# EAGLE design control (EAGLE 6.5.0)
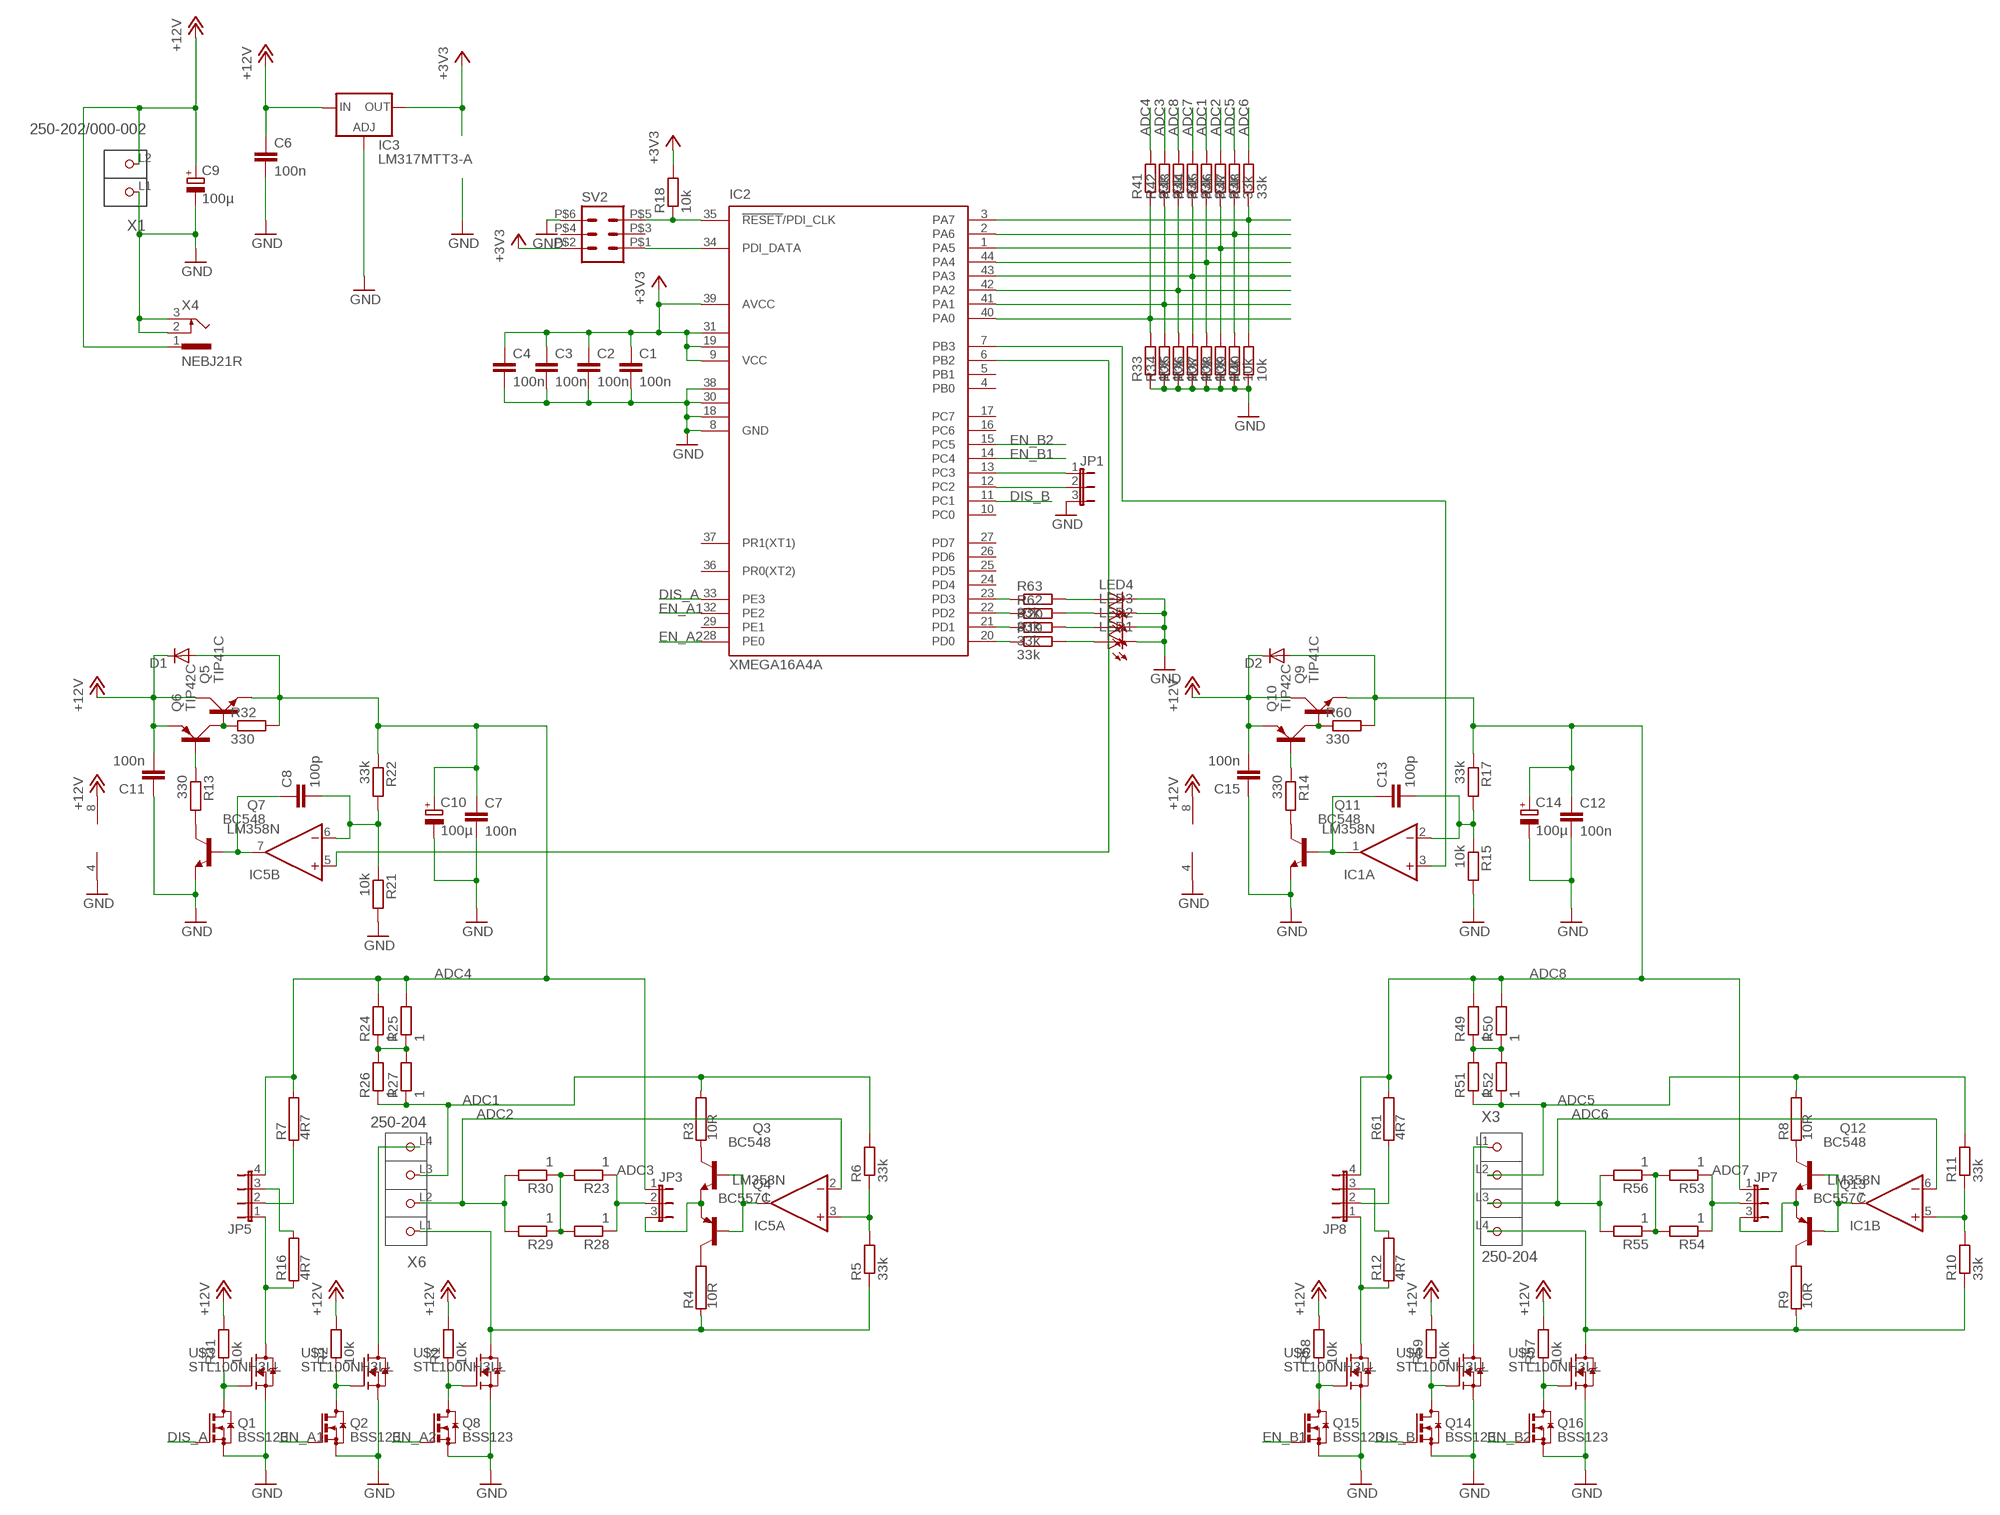
[diagram p0: schematic, sheet 1]

## Parts
C1  100n  C-EUC0805K  [C0805K]
C2  100n  C-EUC0805K  [C0805K]
C3  100n  C-EUC0805K  [C0805K]
C4  100n  C-EUC0805K  [C0805K]
C6  100n  C-EUC0805K  [C0805K]
C7  100n  C-EUC0805K  [C0805K]
C8  100p  C-EUC0805K  [C0805K]
C9  100µ  CPOL-EUE2.5-7  [E2,5-7]
C10  100µ  CPOL-EUE2.5-7  [E2,5-7]
C11  100n  C-EUC0805  [C0805]
C12  100n  C-EUC0805K  [C0805K]
C13  100p  C-EUC0805K  [C0805K]
C14  100µ  CPOL-EUE2.5-7  [E2,5-7]
C15  100n  C-EUC0805  [C0805]
D1  DIODE-DO41-7.6  [DO41-7.6]
D2  DIODE-DO41-7.6  [DO41-7.6]
IC1  LM358N  [DIL08]
IC2  XMEGA16A4A  [TQFP44]
IC3  LM317MTT3-A  [SOT223]
IC5  LM358N  [DIL08]
JP1  JP2E  [JP2]
JP3  JP2E  [JP2]
JP5  JP4E  [JP4]
JP7  JP2E  [JP2]
JP8  JP4E  [JP4]
LED1  LEDCHIPLED_0805  [CHIPLED_0805]
LED2  LEDCHIPLED_0805  [CHIPLED_0805]
LED3  LEDCHIPLED_0805  [CHIPLED_0805]
LED4  LEDCHIPLED_0805  [CHIPLED_0805]
Q1  BSS123  [SOT23]
Q2  BSS123  [SOT23]
Q3  BC548  [TO92-EBC]
Q4  BC557C  [TO92-EBC]
Q5  TIP41C  [TO220AV]
Q6  TIP42C  [TO220AV]
Q7  BC548  [TO92-EBC]
Q8  BSS123  [SOT23]
Q9  TIP41C  [TO220AV]
Q10  TIP42C  [TO220AV]
Q11  BC548  [TO92-EBC]
Q12  BC548  [TO92-EBC]
Q13  BC557C  [TO92-EBC]
Q14  BSS123  [SOT23]
Q15  BSS123  [SOT23]
Q16  BSS123  [SOT23]
R1  10k  R-EU_M0805  [M0805]
R2  10k  R-EU_M0805  [M0805]
R3  10R  RHPS58  [HPS58]
R4  10R  RHPS58  [HPS58]
R5  33k  R-EU_M0805  [M0805]
R6  33k  R-EU_M0805  [M0805]
R7  4R7  RKH208-8R  [KH208R-8]
R8  10R  RHPS58  [HPS58]
R9  10R  RHPS58  [HPS58]
R10  33k  R-EU_M0805  [M0805]
R11  33k  R-EU_M0805  [M0805]
R12  4R7  RKH208-8R  [KH208R-8]
R13  330  R-EU_M0805  [M0805]
R14  330  R-EU_M0805  [M0805]
R15  10k  R-EU_M0805  [M0805]
R16  4R7  RKH208-8R  [KH208R-8]
R17  33k  R-EU_M0805  [M0805]
R18  10k  R-EU_M0805  [M0805]
R19  33k  R-EU_M0805  [M0805]
R20  33k  R-EU_M0805  [M0805]
R21  10k  R-EU_M0805  [M0805]
R22  33k  R-EU_M0805  [M0805]
R23  1  R-EU_0207/2V  [0207/2V]
R24  1  R-EU_0207/2V  [0207/2V]
R25  1  R-EU_0207/2V  [0207/2V]
R26  1  R-EU_0207/2V  [0207/2V]
R27  1  R-EU_0207/2V  [0207/2V]
R28  1  R-EU_0207/2V  [0207/2V]
R29  1  R-EU_0207/2V  [0207/2V]
R30  1  R-EU_0207/2V  [0207/2V]
R31  10k  R-EU_M0805  [M0805]
R32  330  R-EU_M0805  [M0805]
R33  10k  R-EU_M0805  [M0805]
R34  10k  R-EU_M0805  [M0805]
R35  10k  R-EU_M0805  [M0805]
R36  10k  R-EU_M0805  [M0805]
R37  10k  R-EU_M0805  [M0805]
R38  10k  R-EU_M0805  [M0805]
R39  10k  R-EU_M0805  [M0805]
R40  10k  R-EU_M0805  [M0805]
R41  33k  R-EU_M0805  [M0805]
R42  33k  R-EU_M0805  [M0805]
R43  33k  R-EU_M0805  [M0805]
R44  33k  R-EU_M0805  [M0805]
R45  33k  R-EU_M0805  [M0805]
R46  33k  R-EU_M0805  [M0805]
R47  33k  R-EU_M0805  [M0805]
R48  33k  R-EU_M0805  [M0805]
R49  1  R-EU_0207/2V  [0207/2V]
R50  1  R-EU_0207/2V  [0207/2V]
R51  1  R-EU_0207/2V  [0207/2V]
R52  1  R-EU_0207/2V  [0207/2V]
R53  1  R-EU_0207/2V  [0207/2V]
R54  1  R-EU_0207/2V  [0207/2V]
R55  1  R-EU_0207/2V  [0207/2V]
R56  1  R-EU_0207/2V  [0207/2V]
R57  10k  R-EU_M0805  [M0805]
R58  10k  R-EU_M0805  [M0805]
R59  10k  R-EU_M0805  [M0805]
R60  330  R-EU_M0805  [M0805]
R61  4R7  RKH208-8R  [KH208R-8]
R62  33k  R-EU_M0805  [M0805]
R63  33k  R-EU_M0805  [M0805]
SV2  ML66S  [ML6S]
U$1  STL100NH3LL  [PG-TDSON-8]
U$2  STL100NH3LL  [PG-TDSON-8]
U$3  STL100NH3LL  [PG-TDSON-8]
U$4  STL100NH3LL  [PG-TDSON-8]
U$5  STL100NH3LL  [PG-TDSON-8]
U$6  STL100NH3LL  [PG-TDSON-8]
X1  250-202/000-002  [P-250-202]
X3  250-204  [P-250-204]
X4  NEBJ21R  [NEBJ21R]
X6  250-204  [P-250-204]

## Nets
+3V3: C1.1 C2.1 C3.1 C4.1 IC2.9(VCC) IC2.19(VCC1) IC2.31(VCC2) IC2.39(AVCC) IC3.2(OUT) R18.2 SV2.P$2
+12V: C6.1 C9.+ C11.2 C15.2 D1.C D2.C IC1.8(P:V+) IC3.3(IN) IC5.8(P:V+) Q5.C Q6.E Q9.C Q10.E R1.2 R2.2 R31.2 R57.2 R58.2 R59.2 X1.L2(P2) X4.1
ADC1: R3.2 R6.2 R26.1 R27.1 R45.2 X6.L3(P3)
ADC2: IC5.2(A:-IN) R29.2 R30.2 R46.2 X6.L2(P2)
ADC3: JP3.2 R23.1 R28.1 R42.2
ADC4: C7.1 C10.+ D1.A JP3.1 JP5.4 Q5.E R7.2 R22.1 R24.2 R25.2 R32.2 R41.2
ADC5: R8.2 R11.2 R47.2 R51.1 R52.1 X3.L2(P2)
ADC6: IC1.6(B:-IN) R48.2 R55.2 R56.2 X3.L3(P3)
ADC7: JP7.2 R44.2 R53.1 R54.1
ADC8: C12.1 C14.+ D2.A JP7.1 JP8.4 Q9.E R17.1 R43.2 R49.2 R50.2 R60.2 R61.2
DIS_A: IC2.33(PE3) Q1.1(G)
DIS_B: IC2.11(PC1) Q14.1(G)
EN_A1: IC2.32(PE2) Q2.1(G)
EN_A2: IC2.28(PE0) Q8.1(G)
EN_B1: IC2.14(PC4) Q15.1(G)
EN_B2: IC2.15(PC5) Q16.1(G)
GND: C1.2 C2.2 C3.2 C4.2 C6.2 C7.2 C9.- C10.- C11.1 C12.2 C14.- C15.1 IC1.4(P:V-) IC2.8(GND) IC2.18(GND1) IC2.30(GND2) IC2.38(GND3) IC3.1(ADJ) IC5.4(P:V-) JP1.3 LED1.C LED2.C LED3.C LED4.C Q1.2(S) Q2.2(S) Q7.E Q8.2(S) Q11.E Q14.2(S) Q15.2(S) Q16.2(S) R15.2 R21.2 R33.1 R34.1 R35.1 R36.1 R37.1 R38.1 R39.1 R40.1 SV2.P$6 U$1.1(S) U$1.2(S) U$1.3(S) U$2.1(S) U$2.2(S) U$2.3(S) U$3.1(S) U$3.2(S) U$3.3(S) U$4.1(S) U$4.2(S) U$4.3(S) U$5.1(S) U$5.2(S) U$5.3(S) U$6.1(S) U$6.2(S) U$6.3(S) X1.L1(P1) X4.2 X4.3
N$1: R4.1 R5.1 U$2.5(D) U$2.6(D) U$2.7(D) U$2.8(D) U$2.TH(D) X6.L1(P1)
N$2: R9.1 R10.1 U$5.5(D) U$5.6(D) U$5.7(D) U$5.8(D) U$5.TH(D) X3.L4(P4)
N$3: U$4.5(D) U$4.6(D) U$4.7(D) U$4.8(D) U$4.TH(D) X3.L1(P1)
N$4: U$1.5(D) U$1.6(D) U$1.7(D) U$1.8(D) U$1.TH(D) X6.L4(P4)
N$5: IC2.20(PD0) R19.1
N$6: Q1.3(D) R31.1 U$3.4(G)
N$7: Q3.C R3.1
N$8: Q4.C R4.2
N$9: IC5.1(A:OUT) Q3.B Q4.B
N$10: IC2.21(PD1) R20.1
N$11: IC5.3(A:+IN) R5.2 R6.1
N$12: Q12.C R8.1
N$13: Q7.C R13.2
N$14: JP5.1 R16.1 U$3.5(D) U$3.6(D) U$3.7(D) U$3.8(D) U$3.TH(D)
N$15: JP5.3 R16.2
N$16: JP5.2 R7.1
N$17: IC2.35(!RESET!/PDI_CLK) R18.1 SV2.P$5
N$18: IC2.40(PA0) R33.2 R41.1
N$19: IC2.41(PA1) R34.2 R42.1
N$20: IC2.42(PA2) R35.2 R43.1
N$21: IC2.43(PA3) R36.2 R44.1
N$22: IC2.44(PA4) R37.2 R45.1
N$23: IC2.1(PA5) R38.2 R46.1
N$24: IC2.2(PA6) R39.2 R47.1
N$25: IC2.3(PA7) R40.2 R48.1
N$26: Q6.B R13.1
N$27: IC2.13(PC3) JP1.1
N$28: C8.1 IC5.7(B:OUT) Q7.B
N$29: R23.2 R28.2 R29.1 R30.1
N$30: C8.2 IC5.6(B:-IN) R21.1 R22.2
N$31: IC2.6(PB2) IC5.5(B:+IN)
N$32: Q5.B Q6.C R32.1
N$33: R24.1 R25.1 R26.2 R27.2
N$34: JP3.3 Q3.E Q4.E
N$35: Q2.3(D) R2.1 U$1.4(G)
N$36: Q8.3(D) R1.1 U$2.4(G)
N$37: Q13.C R9.2
N$38: IC2.12(PC2) JP1.2
N$39: IC2.22(PD2) R62.1
N$40: IC1.7(B:OUT) Q12.B Q13.B
N$41: IC1.5(B:+IN) R10.2 R11.1
N$42: JP8.1 R12.1 U$6.5(D) U$6.6(D) U$6.7(D) U$6.8(D) U$6.TH(D)
N$43: JP8.3 R12.2
N$44: IC2.34(PDI_DATA) SV2.P$1
N$45: JP8.2 R61.1
N$46: C13.1 IC1.1(A:OUT) Q11.B
N$47: C13.2 IC1.2(A:-IN) R15.1 R17.2
N$48: IC1.3(A:+IN) IC2.7(PB3)
N$49: Q9.B Q10.C R60.1
N$50: Q11.C R14.2
N$51: Q10.B R14.1
N$52: R49.1 R50.1 R51.2 R52.2
N$53: R53.2 R54.2 R55.1 R56.1
N$54: JP7.3 Q12.E Q13.E
N$55: Q14.3(D) R59.1 U$4.4(G)
N$56: Q15.3(D) R58.1 U$6.4(G)
N$57: Q16.3(D) R57.1 U$5.4(G)
N$58: IC2.23(PD3) R63.1
N$59: LED4.A R63.2
N$60: LED3.A R62.2
N$61: LED2.A R20.2
N$62: LED1.A R19.2
Unconnected: IC2.4(PB0) IC2.5(PB1) IC2.10(PC0) IC2.16(PC6) IC2.17(PC7) IC2.24(PD4) IC2.25(PD5) IC2.26(PD6) IC2.27(PD7) IC2.29(PE1) IC2.36(PR0(XT2)) IC2.37(PR1(XT1)) SV2.P$3 SV2.P$4

## Library data of the parts
C1-C4 C6-C8 C11-C13 C15 = resistor:C-EU: CAPACITOR, European symbol
C9 C10 C14 = resistor:CPOL-EU: POLARIZED CAPACITOR, European symbol
D1 D2 = diode:DIODE-: DIODE
IC1 IC5 = linear:LM358: OP AMP also LM158; LM258; LM2904 Source: http://cache.national.com/ds/LM/LM158.pdf
IC2 = atmel:XMEGA16A4: MICROCONTROLLER Features High-performance, Low-power 8/16-bit AVR XMEGA Microcontroller Non-Volatile Program and Data Memories - 16 KB - 128 KB of In-System Self-Programmable Flash - 4 KB - 8 KB Boot Code Section with Independent Lock Bits - 1 KB - 2 KB EEPROM - 2 KB - 8 KB Internal SRAM Peripheral Features - Four-channel DMA Controller with support for external requests - Eight-channel Event System - Five 16-bit Timer/Counters Three Timer/Counters with 4 Output Compare or Input Capture channels Two Timer/Counters with 2 Output Compare or Input Capture channels High-Resolution Extensions on all Timer/Counters Advanced Waveform Extension on one Timer/Counter - Five USARTs IrDA Extension on one USART - Two Two-Wire Interfaces with dual address match (I2C and SMBus compatible) - Two SPIs (Serial Peripheral Interfaces) peripherals - AES and DES Crypto Engine - 16-bit Real Time Counter with Separate Oscillator - One Twelve-channel, 12-bit, 2 Msps Analog to Digital Converter - One Two-channel, 12-bit, 1 Msps Digital to Analog Converter - Two Analog Comparators with Window compare function - External Interrupts on all General Purpose I/O pins - Programmable Watchdog Timer with Separate On-chip Ultra Low Power Oscillator Special Microcontroller Features - Power-on Reset and Programmable Brown-out Detection - Internal and External Clock Options with PLL - Programmable Multi-level Interrupt Controller - Sleep Modes: Idle, Power-down, Standby, Power-save, Extended Standby - Advanced Programming, Test and Debugging Interfaces PDI (Program and Debug Interface) for programming, test and debugging I/O and Packages - 34 Programmable I/O Lines - 44 - lead TQFP - 44 - pad VQFN/QFN - 49 - ball VFBGA Operating Voltage - 1.6 - 3.6V Speed performance - 0 - 12 MHz @ 1.6 - 3.6V - 0 - 32 MHz @ 2.7 - 3.6V Drawn by Dipl.-Ing. (FH) Robert Siegler Created: 27.05.09; OC_FARNELL: unknown; OC_NEWARK: unknown
IC3 = v-reg:LM317?*: 500 mA Adjustable Output Positive Voltage Regulator Source: http://www.onsemi.co.jp .. LM317M-D.PDF
JP1 JP3 JP7 = jumper:JP2E: JUMPER
JP5 JP8 = jumper:JP4E: JUMPER
LED1-LED4 = led:LED: LED OSRAM: - CHIPLED LG R971, LG N971, LY N971, LG Q971, LY Q971, LO R971, LY R971 LH N974, LH R974 LS Q976, LO Q976, LY Q976 LO Q996 - Hyper CHIPLED LW Q18S LB Q993, LB Q99A, LB R99A - SideLED LS A670, LO A670, LY A670, LG A670, LP A670 LB A673, LV A673, LT A673, LW A673 LH A674 LY A675 LS A676, LA A676, LO A676, LY A676, LW A676 LS A679, LY A679, LG A679 - Hyper Micro SIDELED® LS Y876, LA Y876, LO Y876, LY Y876 LT Y87S - SmartLED LW L88C, LW L88S LB L89C, LB L89S, LG L890 LS L89K, LO L89K, LY L89K LS L896, LA L896, LO L896, LY L896 - TOPLED LS T670, LO T670, LY T670, LG T670, LP T670 LSG T670, LSP T670, LSY T670, LOP T670, LYG T670 LG T671, LOG T671, LSG T671 LB T673, LV T673, LT T673, LW T673 LH T674 LS T676, LA T676, LO T676, LY T676, LB T676, LH T676, LSB T676, LW T676 LB T67C, LV T67C, LT T67C, LS T67K, LO T67K, LY T67K, LW E67C LS E67B, LA E67B, LO E67B, LY E67B, LB E67C, LV E67C, LT E67C LW T67C LS T679, LY T679, LG T679 LS T770, LO T770, LY T770, LG T770, LP T770 LB T773, LV T773, LT T773, LW T773 LH T774 LS E675, LA E675, LY E675, LS T675 LS T776, LA T776, LO T776, LY T776, LB T776 LHGB T686 LT T68C, LB T68C - Hyper Mini TOPLED® LB M676 - Mini TOPLED Santana® LG M470 LS M47K, LO M47K, LY M47K Source: http://www.osram.convergy.de LUXEON: - LUMILED® LXK2-PW12-R00, LXK2-PW12-S00, LXK2-PW14-U00, LXK2-PW14-V00 LXK2-PM12-R00, LXK2-PM12-S00, LXK2-PM14-U00 LXK2-PE12-Q00, LXK2-PE12-R00, LXK2-PE12-S00, LXK2-PE14-T00, LXK2-PE14-U00 LXK2-PB12-K00, LXK2-PB12-L00, LXK2-PB12-M00, LXK2-PB14-N00, LXK2-PB14-P00, LXK2-PB14-Q00 LXK2-PR12-L00, LXK2-PR12-M00, LXK2-PR14-Q00, LXK2-PR14-R00 LXK2-PD12-Q00, LXK2-PD12-R00, LXK2-PD12-S00 LXK2-PH12-R00, LXK2-PH12-S00 LXK2-PL12-P00, LXK2-PL12-Q00, LXK2-PL12-R00 Source: www.luxeon.com KINGBRIGHT: KA-3528ASYC Source: www.kingbright.com
Q1 Q2 Q8 Q14-Q16 = transistor-small-signal:BSS123: N-CHANNEL MOS FET
Q3 Q7 Q11 Q12 = transistor-npn:BC548*: NPN Transistor
Q4 Q13 = transistor-pnp:BC557*: PNP Transistror
Q5 Q9 = transistor-power:TIP41C: NPN TRANSISTOR
Q6 Q10 = transistor-power:TIP42C: PNP TRANSISTOR
R1 R2 R5 R6 R10 R11 R13-R15 R17-R60 R62 R63 = resistor:R-EU_: RESISTOR, European symbol
R3 R4 R7-R9 R12 R16 R61 = resistor-power:R: Power Resitor; OC_FARNELL: unknown; OC_NEWARK: unknown
SV2 = con-ml:ML6: HARTING
U$1-U$6 = teile:STL100NH3LL: STL100NH3LL n-fet 30V 12,5A(100A) 3,2mohm
X1 = con-wago_250:250-202/000-002: Serie 250, Stand: 01.01.2012. Die jeweils aktuellen Daten zu diesem Artikel finden Sie in unserem Produktkatalog, den Sie unter www.wago.com einsehen können. As of: 01/01/2012. Please find the newest data for this article in our product catalogue, which can be viewed under www.wago.com.
X3 X6 = con-wago_250:250-204: Serie 250, 1-Leiter-Klemmenleiste für Leiterplatten 1 Lötstift/Pol versetzt / Series 250, 1-conductor PCB terminal strip 1 solder pin/pole, staggered Polzahl / Pole No.: 4 Rastermaß / Pitch: 3.5 mm Bemessungsspannung / Rated Voltage: 320 V Nennstrom / Nominal Current: 8 A Leiterquerschnitt / Conductor Size: 0.2 - 1.5 mm² Anschlusstechnik / Connection Technology: Steckklemm-Anschluss Lötstiftlänge: / Solder Pin Length: 3.6 mm Leitereinführung (zur Platine) / Conductor entry angle (to PCB): 45 ° Farbe / Color: grau / gray Stand: 01.01.2012. Die jeweils aktuellen Daten zu diesem Artikel finden Sie in unserem Produktkatalog, den Sie unter www.wago.com einsehen können. As of: 01/01/2012. Please find the newest data for this article in our product catalogue, which can be viewed under www.wago.com.
X4 = con-lumberg:NEBJ21R: Netzgeräte-Einbaukupplung abgewinkelte Ausführung mit Öffner Source: http://www.lumberg.com/Produkte/PDFs/NEB_J21R.pdf MARUSHIN ELECTRIC MFG.CO. LTD - Draw No: MJ196P - NEB J 21 R.pdf; MPN: NEB/J 21 R; OC_FARNELL: 1217039; OC_NEWARK: 97K6460

## Board
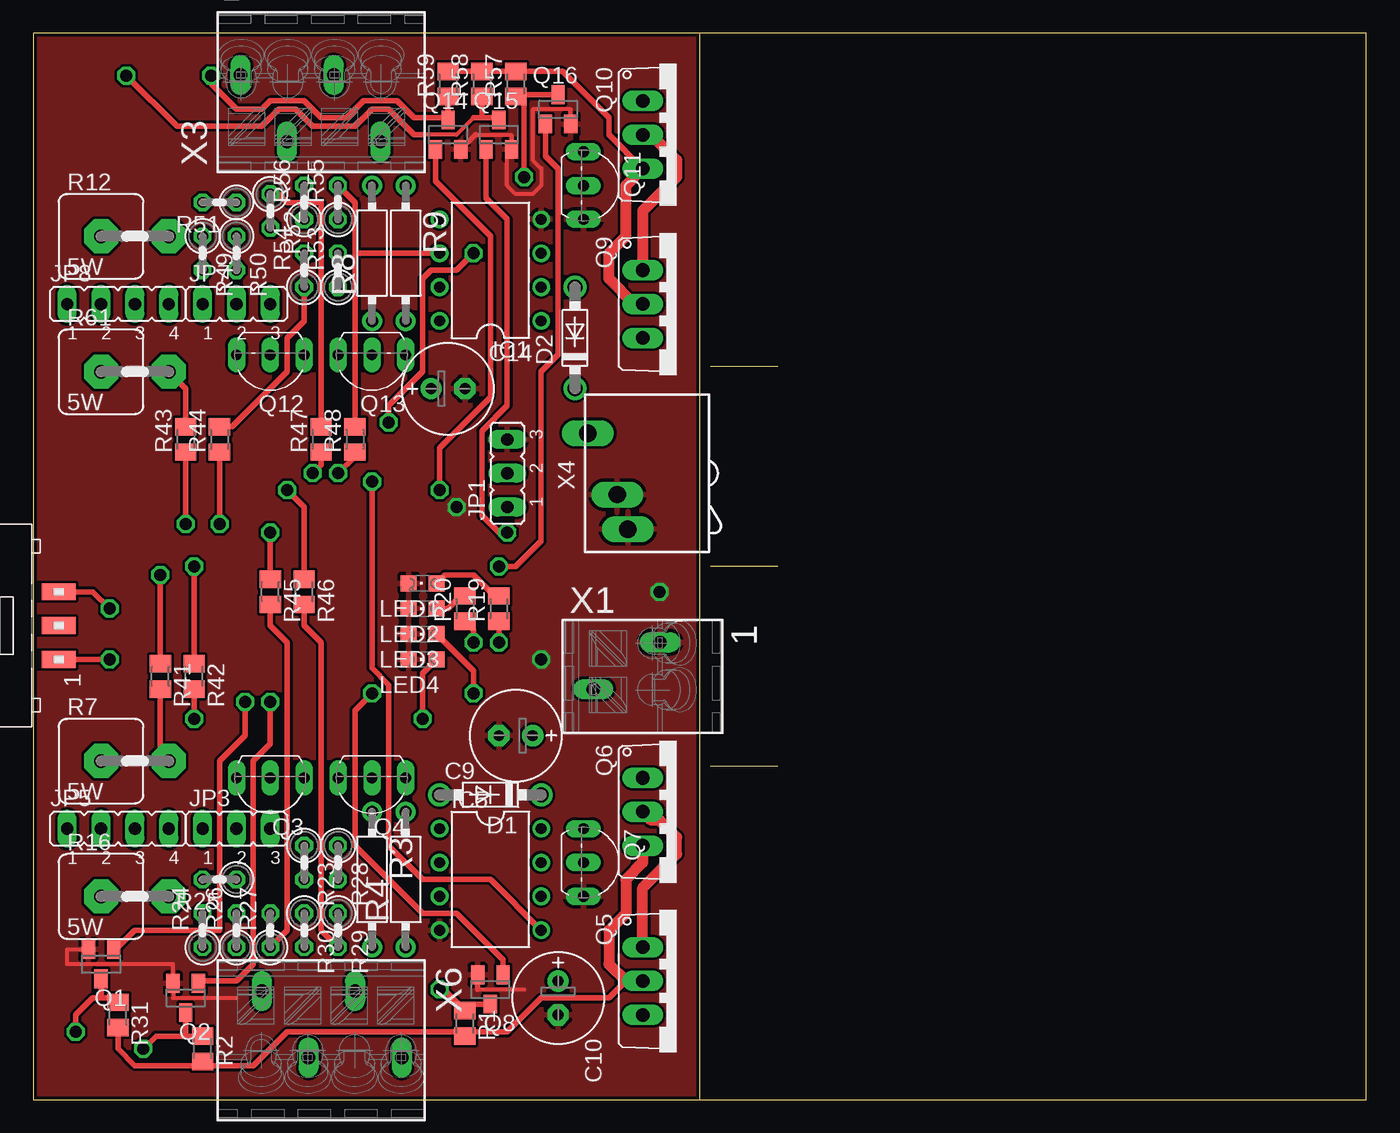
[diagram p1: board, top side]
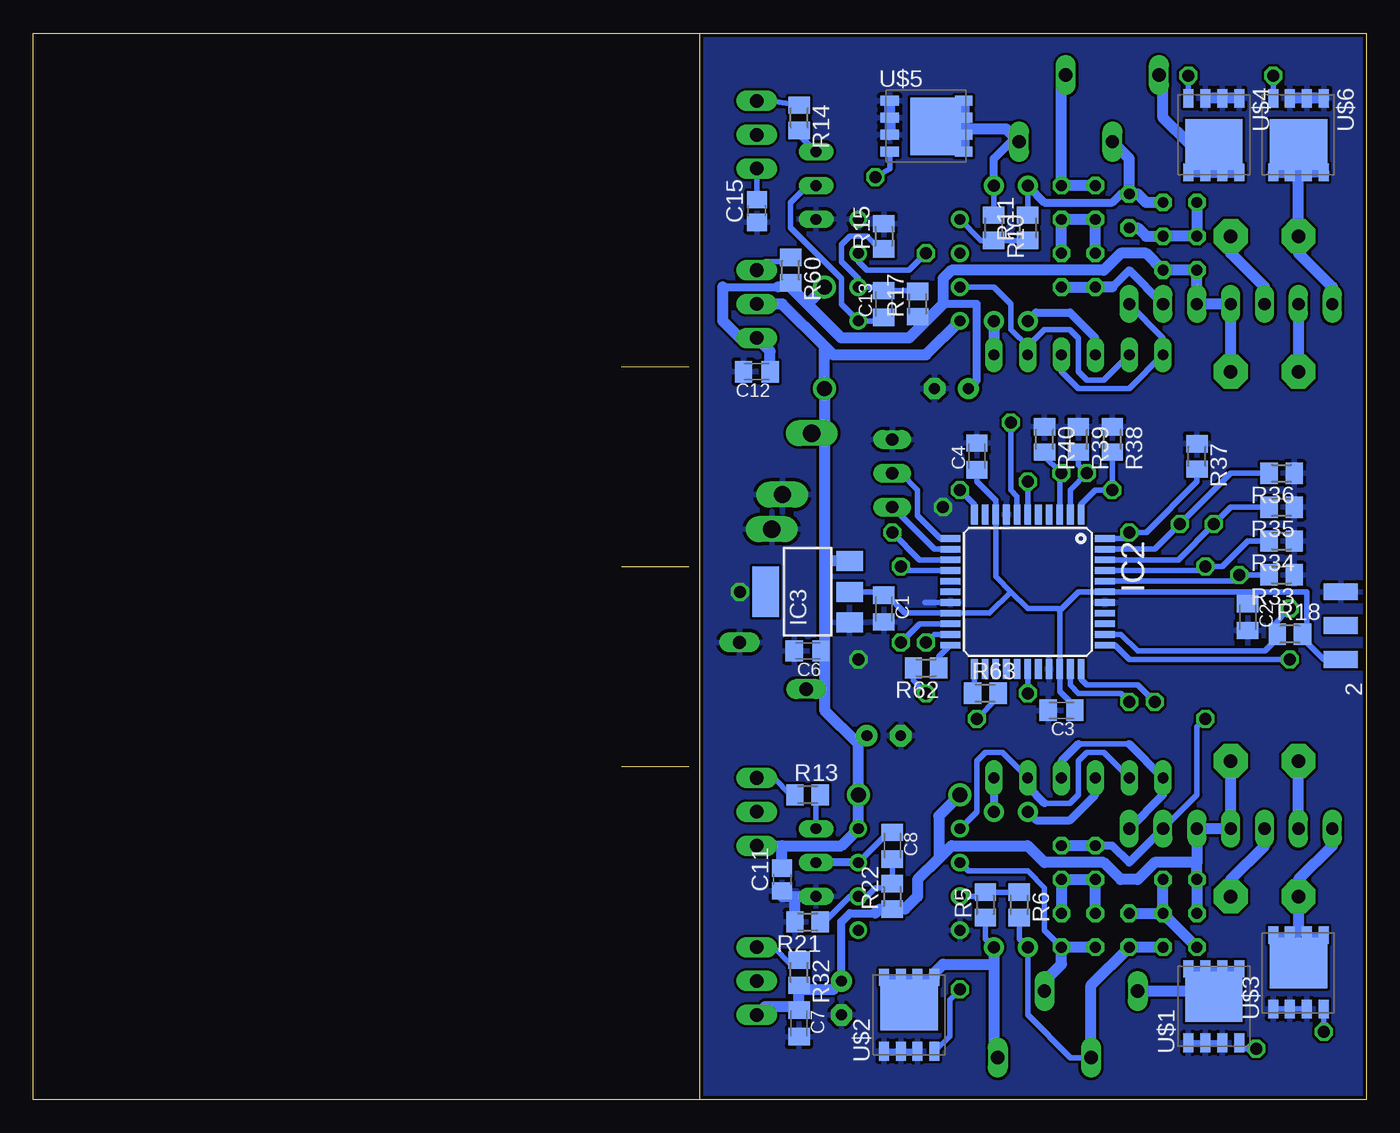
[diagram p2: board, bottom side, seen from below]

Size 100 x 80 mm. Coordinates in mm from the lower left corner, seen from the top.
Outline: 50,0 0,0 0,80 50,80
Outline: 50,0 100,0 100,80 50,80
Outline: 50,0 50,80
Outline: 55.88,40 50.8,40
Outline: 55.88,25 50.8,25
Outline: 55.88,55 50.8,55
Copper layers (1*16): Top 0.035mm / dielectric 1.5mm / Bottom 0.035mm
Design rules "default *": minimum track width 10mil, minimum drill 24mil, track to track 8mil, track to pad 8mil, pad to pad 8mil, via to via 8mil, smd to smd 8mil, copper to edge 10mil, drill to drill 8mil, minimum pad ring 10mil, minimum via ring 8mil, stop-mask expansion 4mil, vias tented up to drill 0mil, thermal gap 10mil

### Footprints (pad centres in the part's own frame; a part is rotated, then mirrored left to right if it is on the bottom)
C0805K = smd 1.3 x 1.6: 1 -1,0; 2 1,0
E2,5-7 = drill 0.813 pad 1.6: + -1.27,0 | drill 0.813 pad 1.6 octagon: - 1.27,0
C0805 = smd 1.3 x 1.5: 1 -0.85,0; 2 0.85,0
DO41-7.6 = drill 1.1 pad 1.7: A 3.81,0; C -3.81,0
DIL08 = drill 0.813 pad 1.27: 1 -3.81,-3.81; 2 -1.27,-3.81; 3 1.27,-3.81; 4 3.81,-3.81; 5 3.81,3.81; 6 1.27,3.81; 7 -1.27,3.81; 8 -3.81,3.81
TQFP44 = smd 1.5 x 0.5: 1 -5.8,4; 2 -5.8,3.2; 3 -5.8,2.4; 4 -5.8,1.6; 5 -5.8,0.8; 6 -5.8,0; 7 -5.8,-0.8; 8 -5.8,-1.6; 9 -5.8,-2.4; 10 -5.8,-3.2; 11 -5.8,-4; 23 5.8,-4; 24 5.8,-3.2; 25 5.8,-2.4; 26 5.8,-1.6; 27 5.8,-0.8; 28 5.8,0; 29 5.8,0.8; 30 5.8,1.6; 31 5.8,2.4; 32 5.8,3.2; 33 5.8,4 | smd 0.5 x 1.5: 12 -4,-5.8; 13 -3.2,-5.8; 14 -2.4,-5.8; 15 -1.6,-5.8; 16 -0.8,-5.8; 17 0,-5.8; 18 0.8,-5.8; 19 1.6,-5.8; 20 2.4,-5.8; 21 3.2,-5.8; 22 4,-5.8; 34 4,5.8; 35 3.2,5.8; 36 2.4,5.8; 37 1.6,5.8; 38 0.8,5.8; 39 0,5.8; 40 -0.8,5.8; 41 -1.6,5.8; 42 -2.4,5.8; 43 -3.2,5.8; 44 -4,5.8
SOT223 = smd 1.5 x 2: 1 -2.3,-3.15; 2 0,-3.15; 3 2.3,-3.15 | smd 3.8 x 2: 4 0,3.15
JP2 = drill 0.914 long: 1 -2.54,0; 2 0,0; 3 2.54,0
JP4 = drill 0.914 long: 1 -3.81,0; 2 -1.27,0; 3 1.27,0; 4 3.81,0
CHIPLED_0805 = smd 1.2 x 1.2: A 0,-1.05; C 0,1.05
SOT23 = smd 1 x 1.4: 1 -0.95,-1.1; 2 0.95,-1.1; 3 0,1.1
TO92-EBC = drill 0.813 long: B 0,-1.27; C -2.54,-1.27; E 2.54,-1.27
TO220AV = drill 1.016 long: B -2.54,-2.54; C 0,-2.54; E 2.54,-2.54
M0805 = smd 1.3 x 1.6: 1 -0.95,0; 2 0.95,0
HPS58 = drill 0.9 pad 1.5: 1 -5.08,0; 2 5.08,0
KH208R-8 = drill 1.016 pad 2.54 octagon: 1 -2.54,0; 2 2.54,0
0207/2V = drill 0.813 octagon: 1 -1.27,0; 2 1.27,0
ML6S = smd 1.27 x 2.54: P$1 -2.54,0; P$3 0,0; P$5 2.54,0 | smd 1.27 x 2.54 bottom: P$2 -2.54,0; P$4 0,0; P$6 2.54,0
PG-TDSON-8 = smd 1.4 x 0.75: 1 -2.725,1.905; 2 -2.725,0.635; 3 -2.725,-0.635; 4 -2.725,-1.905 | smd 1.3 x 0.75: 5 2.825,-1.905; 6 2.825,-0.635; 7 2.825,0.635; 8 2.825,1.905 | smd 3.78 x 4.305: TH 0.725,0
P-250-202 = drill 1 long: L1 1.3,2.55; L2 -3.7,-0.95
P-250-204 = drill 1 long: L1 1.3,6.05; L2 -3.7,2.55; L3 1.3,-0.95; L4 -3.7,-4.45
NEBJ21R = drill 1.3 pad 1.905 long: 1 -3,-9.2; 2 1.6,-7; 3 4.2,-6.2

### Placement (x,y rotation side)
C1  36.2,36.83 270 bottom
C2  8.89,36.2 270 bottom
C3  22.86,29.21 180 bottom
C4  29.21,48.26 90 bottom
C6  41.91,33.66 180 bottom
C7  42.55,5.71 270 bottom
C8  35.56,19.05 270 bottom
C9  36.2,27.3 180 top
C10  39.37,7.62 270 top
C11  43.81,16.51 90 bottom
C12  45.72,54.61 180 bottom
C13  36.2,59.69 90 bottom
C14  31.11,53.34 0 top
C15  45.72,66.67 90 bottom
D1  34.29,22.86 180 top
D2  40.64,57.15 90 top
IC1  34.29,62.23 90 top
IC2  25.4,38.1 270 bottom
IC3  41.91,38.1 90 bottom
IC5  34.29,16.51 270 top
JP1  35.56,46.99 90 top
JP3  15.24,20.32 0 top
JP5  6.35,20.32 0 top
JP7  15.24,59.69 0 top
JP8  6.35,59.69 0 top
LED1  29.21,38.73 90 top
LED2  29.21,36.83 90 top
LED3  29.21,34.92 90 top
LED4  29.21,33.02 90 top
Q1  5.08,10.16 180 top
Q2  11.43,7.62 180 top
Q3  17.78,22.86 180 top
Q4  25.4,22.86 180 top
Q5  48.26,8.89 270 top
Q6  48.26,21.59 270 top
Q7  42.55,17.78 270 top
Q8  34.29,8.26 180 top
Q9  48.26,59.69 270 top
Q10  48.26,72.39 270 top
Q11  42.55,68.58 270 top
Q12  17.78,54.61 180 top
Q13  25.4,54.61 180 top
Q14  31.11,72.39 0 top
Q15  34.92,72.39 0 top
Q16  39.37,74.3 0 top
R1  32.38,5.71 270 top
R2  12.7,3.81 270 top
R3  25.4,16.51 270 top
R4  27.94,16.51 90 top
R5  28.57,14.61 90 bottom
R6  26.04,14.61 270 bottom
R7  7.62,25.4 0 top
R8  25.4,63.5 90 top
R9  27.94,63.5 270 top
R10  27.94,65.41 270 bottom
R11  25.4,65.41 90 bottom
R12  7.62,64.77 0 top
R13  41.91,22.86 0 bottom
R14  42.55,73.66 270 bottom
R15  36.2,64.77 90 bottom
R16  7.62,15.24 0 top
R17  33.66,59.69 90 bottom
R18  5.71,34.92 0 bottom
R19  34.92,36.83 90 top
R20  32.38,36.83 90 top
R21  41.91,13.34 180 bottom
R22  35.56,15.24 90 bottom
R23  20.32,17.78 270 top
R24  12.7,12.7 90 top
R25  13.97,16.51 180 top
R26  15.24,12.7 90 top
R27  17.78,12.7 90 top
R28  22.86,17.78 270 top
R29  22.86,12.7 270 top
R30  20.32,12.7 270 top
R31  6.35,6.35 270 top
R32  42.55,9.53 270 bottom
R33  6.35,39.37 180 bottom
R34  6.35,41.91 180 bottom
R35  6.35,44.45 180 bottom
R36  6.35,46.99 180 bottom
R37  12.7,48.26 270 bottom
R38  19.05,49.53 270 bottom
R39  21.59,49.53 270 bottom
R40  24.13,49.53 270 bottom
R41  9.53,31.75 270 top
R42  12.06,31.75 270 top
R43  11.43,49.53 90 top
R44  13.97,49.53 90 top
R45  17.78,38.1 270 top
R46  20.32,38.1 270 top
R47  21.59,49.53 90 top
R48  24.13,49.53 90 top
R49  12.7,63.5 270 top
R50  15.24,63.5 270 top
R51  13.97,67.31 180 top
R52  17.78,66.67 270 top
R53  22.86,62.23 90 top
R54  20.32,62.23 90 top
R55  22.86,67.31 90 top
R56  20.32,67.31 90 top
R57  36.2,76.2 90 top
R58  33.66,76.2 90 top
R59  31.11,76.2 90 top
R60  43.18,62.23 270 bottom
R61  7.62,54.61 0 top
R62  33.02,32.38 180 bottom
R63  28.57,30.48 0 bottom
SV2  1.91,35.56 90 top
U$1  11.43,6.99 90 bottom
U$2  34.29,6.35 90 bottom
U$3  5.08,9.53 90 bottom
U$4  11.43,72.39 270 bottom
U$5  33.02,73.03 0 bottom
U$6  5.08,72.39 270 bottom
X1  45.72,31.75 0 top
X3  21.59,75.56 90 top
X4  50.8,46.99 270 top
X6  21.59,4.45 270 top

### Tracks (layer width: path | path; a pad name or v marks a point on that pad's centre or on a via)
+3V3
  Bottom 0.406: 23,36.69 IC2.31 23,30.61 22.99,30.61 21.86,29.48 C3.1 | 23,36.69 21.59,38.1 IC2.39 8.89,38.1 | 26.67,38.1 25.4,36.83 23.14,36.83 23,36.69 | 26.67,38.1 27.8,39.23 IC2.9 27.8,44.95 29.21,46.35 C4.1 | 26.67,38.1 28.27,36.5 IC2.19 34.59,36.5 35.92,37.83 C1.1 36.47,38.1 38.1,38.1 | 8.89,38.1 4.45,38.1 4.45,34.29 | SV2.P$2 3.17,33.02 4.45,34.29 | R18.2 4.76,34.61 4.45,34.29 | C2.1 8.89,38.1
  Bottom 0.813: 38.1,38.1 IC3.2
+12V
  Top 0.406: 32.38,5.08 35.56,5.08 38.1,7.62 43.18,7.62 44.45,8.89 | R1.2 32.38,5.08 | R59.2 R58.2 R57.2 39.69,77.15 43.18,73.66 43.18,72.39 Q10.E | 32.38,5.08 19.05,5.08 16.51,2.54 13.02,2.54 R2.2 12.38,2.54 7.62,2.54 6.35,3.81 R31.2
  Top 0.813: Q5.C 44.45,8.89 43.18,10.16 43.18,12.7 44.45,13.97 44.45,16.51 45.72,17.78 Q6.E | Q9.C 45.09,59.69 43.18,61.59 43.18,63.5 44.45,64.77 44.45,68.58 Q10.E
  Bottom 0.406: C15.2 Q10.E
  Bottom 0.813: Q6.E 43.81,19.05 | 43.81,19.05 39.37,19.05 IC5.8 D1.C 38.1,26.67 | C11.2 43.81,19.05 | Q9.C 43.81,59.69 40.64,56.52 | 40.64,49.53 D2.C 40.64,56.52 | 40.64,49.53 40.64,40.64 | 40.64,40.64 40.64,33.38 | 40.64,30.48 40.64,33.02 40.64,33.38 | 40.64,30.48 40.64,29.21 38.1,26.67 | 40.64,56.52 40.01,55.88 33.02,55.88 IC1.8 | X4.1 41.1,49.99 40.64,49.53 | IC3.3 40.4,40.4 40.64,40.64 | X1.L2 40.96,30.8 40.64,30.48 | C9.+ 38.1,26.67 | C6.1 40.64,33.38
ADC1
  Top 0.406: R45.2 17.78,35.56 19.05,34.29 19.05,12.7 R27.1
  Bottom 0.406: R6.2 26.04,12.06 R3.2 25.4,6.35 22.2,3.15 X6.L3
  Bottom 0.813: R26.1 R27.1 20.64,8.57 X6.L3
ADC2
  Top 0.406: R46.2 20.32,35.56 21.59,34.29 21.59,12.7 R29.2
  Bottom 0.406: R29.2 24.13,12.7 24.13,15.88 25.4,17.14 29.84,17.14 IC5.2
  Bottom 0.813: R30.2 R29.2 22.86,10.16 24.14,8.88 X6.L2
ADC3  (via drill 0.9)
  Top 0.406: v12.06,28.57 R42.2
  Bottom 0.406: JP3.2 12.7,22.86 12.7,27.94 v12.06,28.57
  Bottom 0.61: JP3.2 17.78,17.78 19.05,19.05 R23.1
  Bottom 0.813: R23.1 R28.1
ADC4
  Top 0.406: R7.2 9.53,26.04 R41.2
  Bottom 0.61: C10.+ 39.37,13.34 38.73,13.97 36.83,13.97 | 36.51,14.29 R22.1
  Bottom 0.813: 36.83,13.97 36.51,14.29 | 32.07,18.1 31.11,19.05 25.4,19.05 24.13,17.78 19.68,17.78 18.41,16.51 17.14,16.51 15.88,17.78 12.7,17.78 | 32.07,18.1 33.66,16.51 33.66,15.24 34.6,14.29 R22.1 | R24.2 R25.2 12.7,17.78 | R7.2 JP5.4 JP3.1 12.7,17.78 | Q5.E 45.09,6.99 42.55,6.99 | 42.55,8.26 40.01,8.26 C10.+ | R32.2 42.55,8.26 | C7.1 42.55,6.99 | 42.55,6.99 42.55,8.26 | D1.A 32.07,21.27 32.07,18.1
ADC5
  Top 0.406: R52.1 18.41,67.94 19.05,67.31 21.59,67.31 R47.2
  Bottom 0.406: R11.2 R8.2
  Bottom 0.61: R8.2 24.13,67.31 19.05,67.31 18.41,67.94 R52.1
  Bottom 0.813: R51.1 16.51,67.31 17.14,67.94 R52.1 17.78,70.61 X3.L2
ADC6
  Top 0.406: R55.2 24.13,67.31 24.13,63.5 | 24.13,63.5 R48.2 | IC1.6 24.13,63.5
  Bottom 0.813: R56.2 R55.2 22.86,76.55 X3.L3
ADC7
  Top 0.406: R44.2 14.92,50.48 19.05,54.61 19.05,57.15 20.32,58.42 R54.1
  Bottom 0.61: JP7.2 17.78,62.23 19.05,60.96
  Bottom 0.813: 19.05,60.96 R54.1 R53.1
ADC8
  Top 0.406: R61.2 11.43,53.34 R43.2
  Bottom 0.61: 48.26,60.96 44.13,60.96 | C14.+ 29.21,53.98 29.21,59.69 31.75,59.69
  Bottom 0.813: R61.2 JP8.4 JP7.1 R49.2 R50.2 16.51,63.5 18.41,63.5 19.68,62.23 31.11,62.23 31.75,61.59 31.75,59.69 33.02,58.42 | 43.13,61.23 R60.2 | 48.26,60.96 48.26,58.42 46.99,57.15 Q9.E 44.72,56.15 C12.1 | 44.13,60.96 R60.2 | R17.1 33.34,58.74 33.02,58.42 | 33.02,58.42 34.29,57.15 39.37,57.15 41.91,59.69 | 41.91,59.69 43.18,60.96 R60.2 | D2.A 41.91,59.69
DIS_A  (via drill 0.9)
  Top 0.406: v15.88,29.84 15.88,27.3 13.97,25.4 13.97,12.7 7.62,12.7 6.18,11.26 Q1.1
  Bottom 0.406: IC2.33 21.4,31.56 20.95,31.11 17.14,31.11 v15.88,29.84
DIS_B  (via drill 0.9)
  Top 0.406: Q14.1 30.16,68.89 34.29,64.77 34.29,52.7 30.48,48.9 v30.48,45.72
  Bottom 0.406: v30.48,45.72 29.4,44.64 IC2.11
EN_A1  (via drill 0.9)
  Top 0.406: Q2.1 12.55,8.89 15.24,8.89 16.51,10.16 16.51,25.4 17.78,26.67 v17.78,29.84
  Bottom 0.406: IC2.32 22.2,31.09 21.59,30.48 18.41,30.48 v17.78,29.84
EN_A2  (via drill 0.9)
  Top 0.406: Q8.1 35.24,10.48 31.75,13.97 29.21,13.97 24.13,19.05 24.13,29.21 v25.4,30.48
  Bottom 0.406: v25.4,30.48 IC2.28
EN_B1  (via drill 0.9)
  Top 0.406: Q15.1 33.98,67.62 35.56,66.04 35.56,52.07 33.66,50.16 33.66,43.81 34.92,42.55 v35.56,42.55
  Bottom 0.406: v35.56,42.55 33.52,40.5 IC2.14
EN_B2  (via drill 0.9)
  Top 0.406: Q16.1 38.42,70.8 39.37,69.85 39.37,55.88 38.1,54.61 38.1,41.91 36.2,40.01 v34.92,40.01
  Bottom 0.406: v34.92,40.01 34.62,39.7 IC2.15
GND  (via drill 0.9)
  Top 0.305: 33.16,72.39 35.88,72.39 35.88,71.44 | Q16.2 40.32,74.3 37.47,74.3 37.47,70.48 38.1,69.85 38.1,68.58 37.47,67.94 36.2,67.94 35.56,68.58 35.56,70.97 Q15.2 | 15.24,7.62 10.48,7.62 Q2.2 10.48,10.16 2.54,10.16 2.54,11.26 Q1.2 | 33.34,8.26 36.83,8.26
  Top 0.406: Q14.2 33.16,72.39 | 35.88,71.44 Q15.2 | Q8.2 33.34,8.26
  Bottom 0.406: IC2.18 33.12,37.3 | U$1.3 U$1.2 U$1.1 | U$3.1 U$3.2 U$3.3 | U$2.3 U$2.2 U$2.1
  Bottom 0.813: C11.1 43.81,15.24 42.86,15.24 | 42.86,15.24 Q7.E | R21.2 42.86,15.24 | U$6.1 U$6.2 U$6.3 | U$4.1 U$4.2 U$4.3 | U$5.1 U$5.2 U$5.3
  other vias: 31.75,44.45 38.1,33.02 46.99,38.1
  pour Top: -2.54,81.28 -2.54,-2.54 53.34,-2.54 53.34,81.28
  pour Bottom: 0,80.01 0,0 50.8,0 50.8,80.01
N$1
  Bottom 0.406: U$2.8 U$2.7 34.58,9.18 | 34.58,9.18 U$2.6 U$2.5 | 34.58,9.18 34.29,8.89 U$2.TH | R5.1 28.57,12.06 R4.1
  Bottom 0.813: R4.1 27.94,10.16 | 27.94,10.16 27.94,4.08 X6.L1 | U$2.5 32.38,9.53 31.75,10.16 27.94,10.16
N$2
  Bottom 0.406: R10.1 R9.1
  Bottom 0.61: R9.1 27.94,70.6 26.68,71.86 X3.L4
  Bottom 0.813: U$5.8 U$5.7 U$5.6 | U$5.TH 31.62,72.82 | 31.62,72.82 U$5.6 | U$5.6 U$5.5 | X3.L4 27,72.82 31.62,72.82
N$3
  Bottom 0.813: 11.43,69.56 U$4.6 U$4.5 | 11.43,69.56 U$4.7 U$4.8 | 11.43,69.56 U$4.TH 13.24,71.67 15.24,73.66 15.24,76.56 X3.L1
N$4
  Bottom 0.406: 11.43,7.62 U$1.TH | 11.52,7.62 U$1.TH | U$1.5 U$1.6 11.43,9.81 | 11.43,9.81 U$1.7 U$1.8 | U$1.TH 11.43,9.81
  Bottom 0.813: X6.L4 11.87,8.14 U$1.TH
N$5  (via drill 0.9)
  Top 0.406: v34.92,34.29 R19.1
  Bottom 0.406: IC2.20 33.52,35.7 v34.92,34.29
N$6  (via drill 0.9)
  Top 0.406: v3.17,5.08 3.17,6.35 4.45,7.62 5.08,7.62 | 5.08,7.62 6.35,7.62 R31.1 | Q1.3 5.08,7.62
  Bottom 0.406: U$3.4 v3.17,5.08
N$7
  Bottom 0.61: R3.1 24.77,20.95 22.23,20.95 20.32,22.86 Q3.C
N$8
  Bottom 0.61: Q4.C R4.2
N$9
  Bottom 0.406: Q3.B 19.68,26.04 20.95,26.04 21.59,25.4 21.59,22.86 22.23,22.23 24.13,22.23 | IC5.1 29.21,21.59 29.21,25.4 28.57,26.04 27.3,26.04 Q4.B
  Bottom 0.61: 24.13,22.23 25.4,23.5 Q4.B
N$10  (via drill 0.9)
  Top 0.406: v33.02,34.29 33.02,35.24 R20.1
  Bottom 0.406: IC2.21 32.41,34.9 v33.02,34.29
N$11
  Bottom 0.406: R6.1 R5.2 28.57,15.24 IC5.3
N$12
  Bottom 0.61: R8.1 24.77,59.05 22.23,59.05 21.59,58.42 20.32,57.15 Q12.C
N$13
  Bottom 0.406: 40.64,22.86 R13.2 41.27,22.55 Q7.C
N$14
  Bottom 0.406: 5.08,12.7 U$3.TH | U$3.5 U$3.6 4.73,12.35 5.08,12.7 | U$3.8 U$3.7 5.43,12.35 5.08,12.7
  Bottom 0.813: JP5.1 2.54,19.05 5.08,16.51 R16.1 5.08,12.7
N$15
  Bottom 0.813: R16.2 10.16,16.51 7.62,19.05 JP5.3
N$16
  Bottom 0.813: JP5.2 R7.1
N$17  (via drill 0.9)
  Top 0.406: v5.71,36.83 4.45,38.1 SV2.P$5
  Bottom 0.406: IC2.35 18.39,34.9 17.14,33.66 7.62,33.66 6.99,34.29 | 6.99,34.29 6.99,35.56 v5.71,36.83 | R18.1 6.67,34.61 6.99,34.29
N$18  (via drill 0.9)
  Top 0.406: v9.53,39.37 R41.1
  Bottom 0.406: IC2.40 9.99,38.9 v9.53,39.37 R33.2
N$19  (via drill 0.9)
  Top 0.406: R42.1 v12.06,40.01
  Bottom 0.406: IC2.41 12.37,39.7 v12.06,40.01 10.79,40.01 8.89,41.91 R34.2
N$20  (via drill 0.9)
  Top 0.406: v11.43,43.18 R43.1
  Bottom 0.406: IC2.42 14.11,40.5 v11.43,43.18 10.16,44.45 R35.2
N$21  (via drill 0.9)
  Top 0.406: R44.1 v13.97,43.18
  Bottom 0.406: IC2.43 15.85,41.3 v13.97,43.18 10.16,46.99 R36.2
N$22  (via drill 0.9)
  Top 0.406: R45.1 v17.78,42.55
  Bottom 0.406: IC2.44 18.23,42.1 v17.78,42.55 16.51,42.55 12.7,46.35 R37.2
N$23  (via drill 0.9)
  Top 0.406: R46.1 20.32,44.45 v19.05,45.72
  Bottom 0.406: R38.2 v19.05,45.72 20.32,45.72 21.4,44.64 IC2.1
N$24  (via drill 0.9)
  Top 0.406: v20.95,46.99 21.59,47.62 R47.1
  Bottom 0.406: IC2.2 22.2,45.74 v20.95,46.99 21.59,47.62 R47.1
N$25  (via drill 0.9)
  Top 0.406: v22.86,46.99 24.13,48.26 R40.2
  Bottom 0.406: IC2.3 23,47.13 | R40.2 24.13,48.26 23,47.13 | 23,47.13 v22.86,46.99
N$26
  Bottom 0.406: Q6.B 44.45,24.13 43.18,22.86 R13.1
N$27
  Bottom 0.406: IC2.13 32.41,41.3 JP1.1
N$28
  Bottom 0.406: IC5.7 35.83,20.05 C8.1
  Bottom 0.61: IC5.7 Q7.B
N$29
  Bottom 0.813: R30.1 R23.2 R28.2 R29.1
N$30
  Bottom 0.406: R21.1 40.64,13.34 38.73,15.24 IC5.6 37.47,15.24 36.83,15.88 35.88,15.88 R22.2 C8.2
N$31  (via drill 0.9)
  Top 0.406: IC5.5 34.29,16.51 29.21,16.51 26.67,19.05 26.67,31.11 25.4,32.38 v25.4,46.35
  Bottom 0.406: v25.4,46.35 IC2.6
N$32
  Top 0.813: Q5.B 45.72,15.88 48.26,18.41 48.26,19.68 46.99,20.95 46.35,20.95 Q6.C
  Bottom 0.406: Q5.B 44.45,11.43 43.18,10.16 42.23,10.16 R32.1
N$33
  Bottom 0.813: R27.2 R26.2 | R24.1 R26.2 | R26.2 R25.1
N$34
  Bottom 0.406: 17.78,26.67 21.59,26.67
  Bottom 0.61: JP3.3 15.24,22.86 Q3.E 17.78,26.67 | 21.59,26.67 22.86,25.4 Q4.E
N$35  (via drill 0.9)
  Top 0.406: R2.1 11.43,4.76 | 11.43,4.76 9.21,4.76 v8.26,3.81 | Q2.3 11.43,4.76
  Bottom 0.406: U$1.4 9.53,3.81 v8.26,3.81
N$36  (via drill 0.9)
  Top 0.406: v30.48,8.26 30.8,8.26 R1.1 32.88,7.16 Q8.3
  Bottom 0.406: U$2.4 31.25,4.76 31.25,7.49 v30.48,8.26
N$37
  Bottom 0.813: R9.2 Q13.C
N$38
  Bottom 0.406: IC2.12 31.94,42.1 33.66,43.81 33.66,45.72 34.92,46.99 JP1.2
N$39
  Bottom 0.406: IC2.22 32.07,33.23 R62.1
N$40
  Bottom 0.406: Q12.B 19.68,53.98 20.95,53.98 21.59,54.61 21.59,57.15 22.23,57.78 24.13,57.78 25.4,56.52 | 25.4,56.52 Q13.B | 25.4,56.52 26.67,57.78 26.67,59.69 27.94,60.96 IC1.7
N$41
  Bottom 0.406: R11.1 R10.2 28.89,64.45 IC1.5
N$42
  Bottom 0.813: JP8.1 2.54,60.96 5.08,63.5 R12.1 5.08,69.56 | U$6.8 U$6.7 5.08,69.56 | U$6.5 U$6.6 | 5.08,69.56 U$6.6 | U$6.6 U$6.TH
N$43
  Bottom 0.813: JP8.3 7.62,60.96 10.16,63.5 R12.2
N$44  (via drill 0.9)
  Top 0.406: v5.71,33.02 SV2.P$1
  Bottom 0.406: IC2.34 18.86,34.1 17.78,33.02 v5.71,33.02
N$45
  Bottom 0.813: JP8.2 R61.1
N$46
  Bottom 0.406: C13.1 36.47,58.42 IC1.1 39.37,59.69 39.37,61.59 43.18,65.41 43.18,67.31 41.91,68.58 Q11.B
N$47
  Bottom 0.406: R17.2 34.34,60.69 C13.2 36.56,60.69 36.83,60.96 IC1.2 38.1,61.59 39.37,62.87 39.37,64.14 38.73,64.77 37.47,64.77 36.52,63.82 R15.1
N$48  (via drill 0.9)
  Top 0.406: v26.67,50.8 26.67,52.07 29.21,54.61 29.21,61.59 29.84,62.23 31.75,62.23 v33.02,63.5
  Bottom 0.406: IC1.3 38.1,62.87 37.47,62.23 34.29,62.23 v33.02,63.5 | IC2.7 26.2,45.25 26.67,45.72 v26.67,50.8
N$49
  Top 0.813: Q10.C 46.35,72.39 48.26,70.48 48.26,69.22 45.72,66.67 Q9.B
  Bottom 0.406: Q9.B 45.09,62.87 43.5,62.87 R60.1
N$50
  Bottom 0.406: R14.2 42.55,72.39 Q11.C
N$51
  Bottom 0.406: Q10.B 44.77,74.93 R14.1
N$52
  Bottom 0.813: R52.2 17.14,65.41 16.51,64.77 R50.1 R49.1 R51.2
N$53
  Bottom 0.813: R53.2 R55.1 R56.1 R54.2
N$54
  Bottom 0.406: JP7.3 15.24,57.15 Q12.E 17.78,53.34 21.59,53.34 22.86,54.61 Q13.E
N$55  (via drill 0.9)
  Top 0.406: R59.1 Q14.3 30.95,73.66 28.57,73.66 27.3,74.93 24.77,74.93 23.5,73.66 21.59,73.66 20.32,74.93 17.78,74.93 17.14,74.3 15.24,74.3 13.34,76.2 v13.34,76.83
  Bottom 0.406: v13.34,76.83 U$4.4
N$56  (via drill 0.9)
  Top 0.305: 33.02,73.66 31.75,72.39 29.21,72.39
  Top 0.406: Q15.3 34.29,73.66 33.66,73.66 | R58.1 33.66,73.66 | 33.66,73.66 33.02,73.66 | 29.21,72.39 28.57,72.39 26.67,74.3 25.4,74.3 24.13,73.03 20.95,73.03 19.68,74.3 18.41,74.3 17.14,73.03 10.79,73.03 v6.99,76.83
  Bottom 0.406: v6.99,76.83 U$6.4
N$57  (via drill 0.9)
  Top 0.406: v36.83,69.22 36.83,74.93 36.51,75.25 R57.1 36.98,75.39 Q16.3
  Bottom 0.406: U$5.4 35.74,69.85 v36.83,69.22
N$58
  Bottom 0.406: IC2.23 29.4,30.48 R63.1
N$59  (via drill 0.9)
  Top 0.406: v29.21,28.57 29.21,31.97 LED4.A
  Bottom 0.406: R63.2 27.62,30.16 v29.21,28.57
N$60  (via drill 0.9)
  Top 0.406: LED3.A 33.02,32.16 v33.02,30.48
  Bottom 0.406: v33.02,30.48 33.97,31.43 R62.2
N$61
  Top 0.406: LED2.A 31.11,36.83 32.06,37.78 R20.2
N$62
  Top 0.406: LED1.A 30.89,39.37 33.02,39.37 34.61,37.78 R19.2